# Altium project AMS_V3.PrjPcb
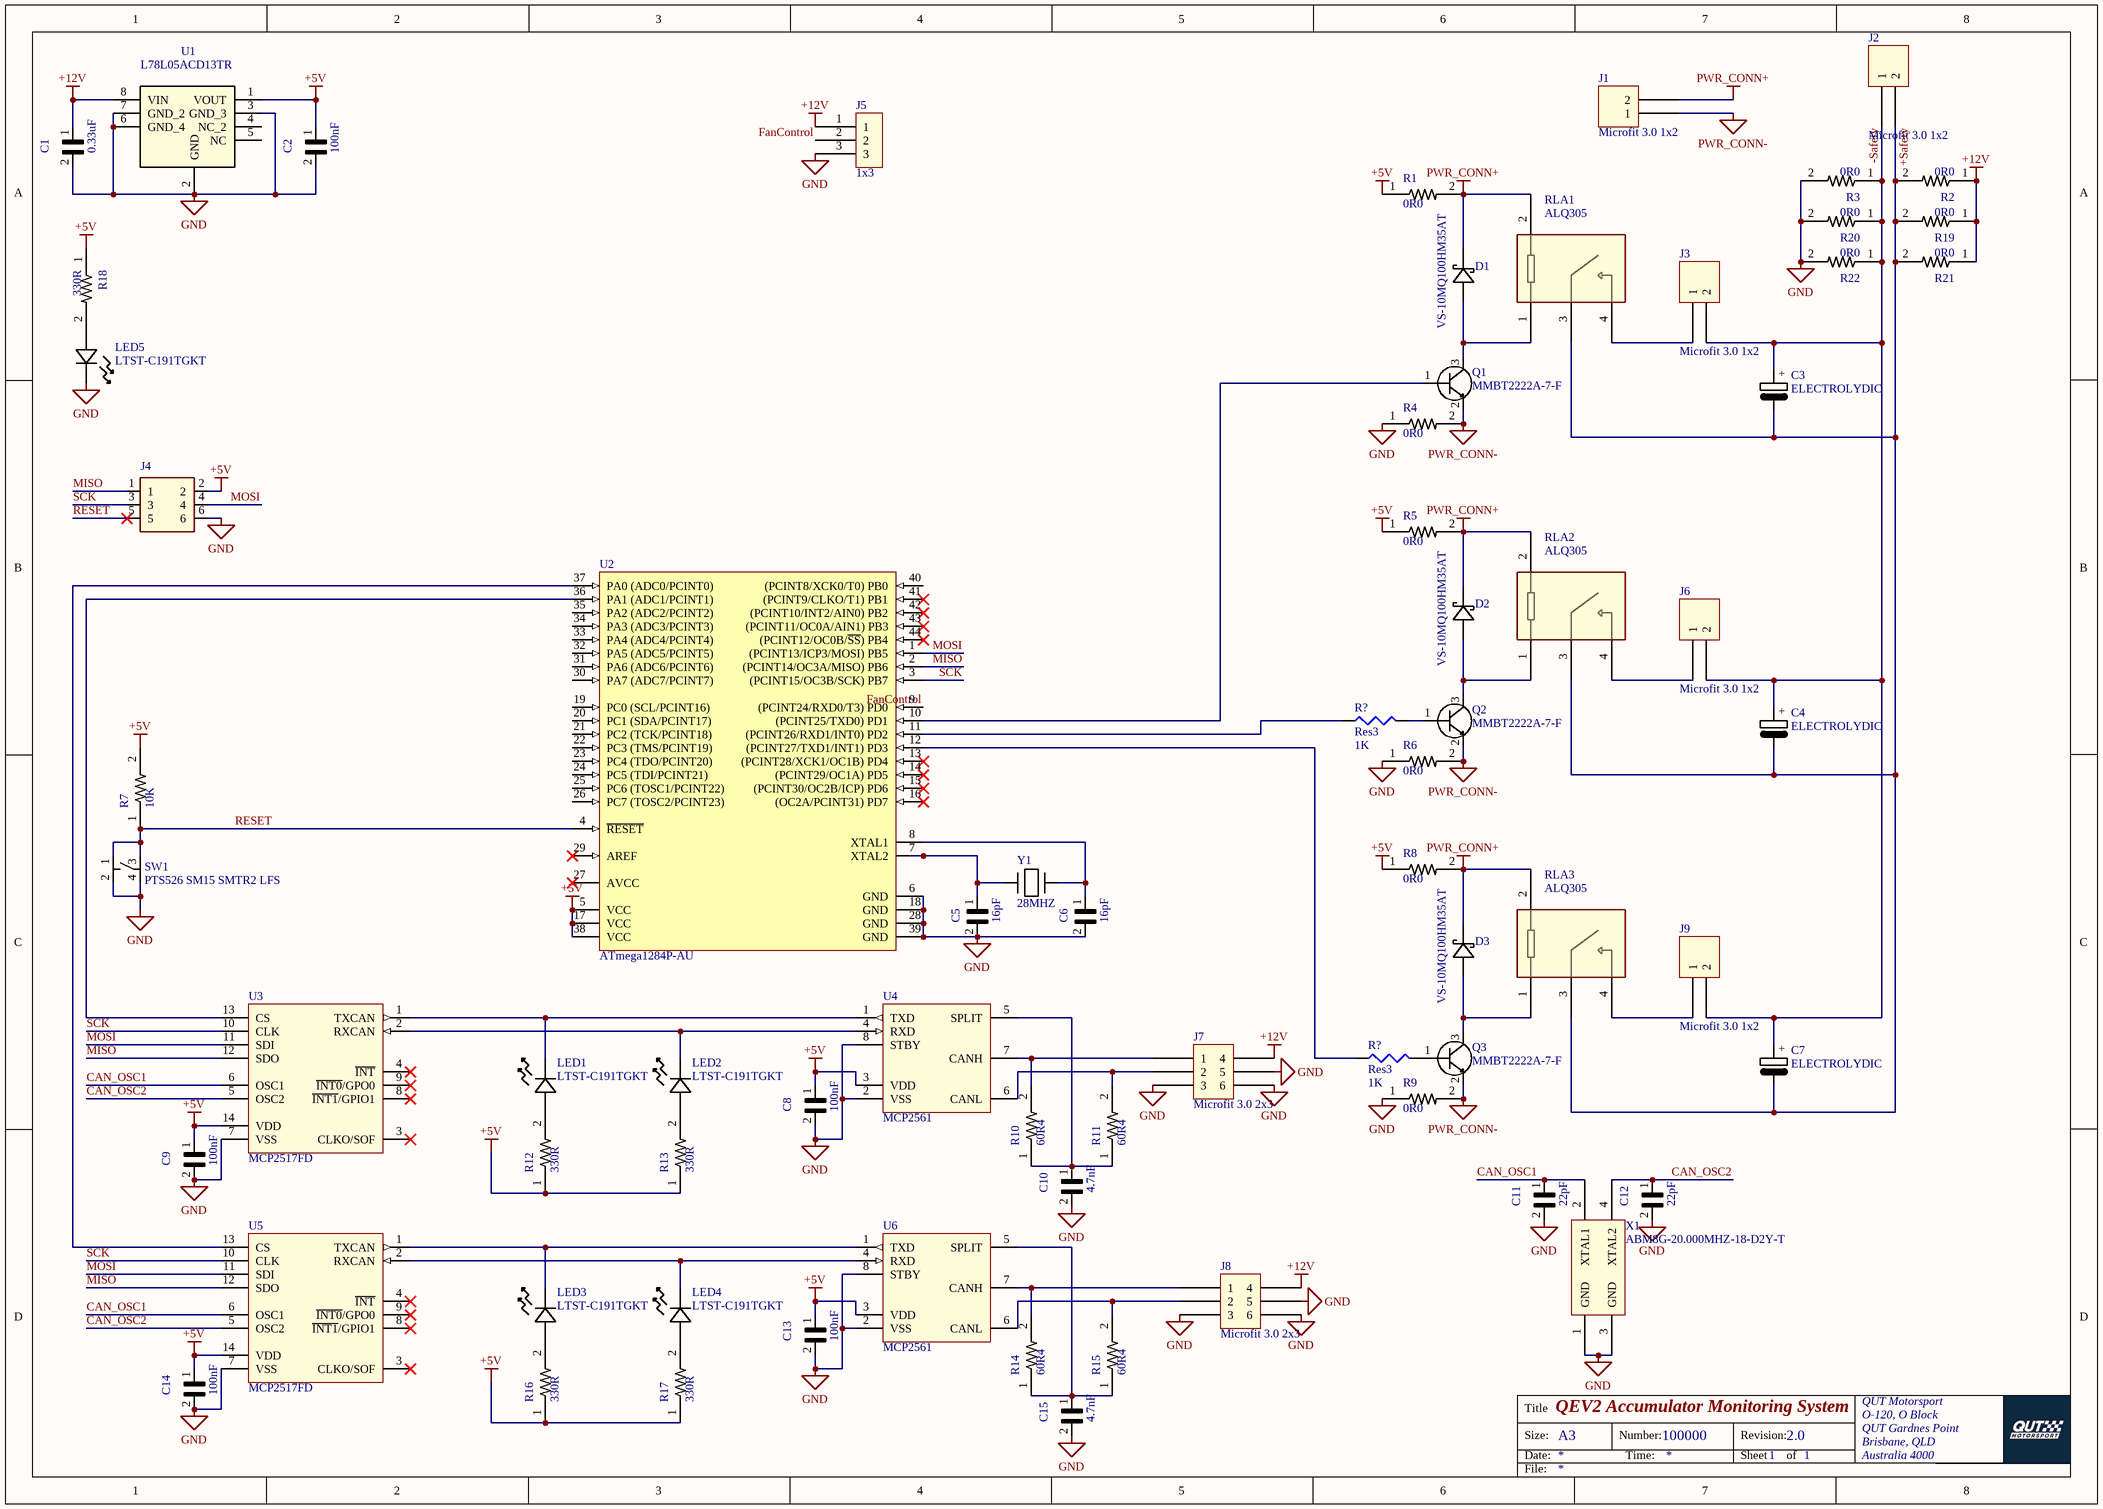
[diagram p0: AMS_V3.SchDoc]
1 sheet, 71 parts. Net scope: global (net labels, ports and power ports of the same name join across sheets).
Board file: AMS_V3.PcbDoc

## Sheet AMS_V3.SchDoc: QEV2 Accumulator Monitoring System
size A3; Author: Alistair Ridge; Organization: QUT Motorsport; Address1: O-120, O Block; Address2: QUT Gardnes Point; Address3: Brisbane, QLD; Address4: Australia 4000; DocumentNumber: 100000; Revision: 2.0; SheetNumber: 1; SheetTotal: 1

### Parts
(Parts that share a designator on the sheet are numbered #1, #2 ... from top to bottom, then left to right.)
C1  0.33uF  [*CAPC1608X95]
C2  100nF  [*CAPC1608X95]
C3  ELECTROLYDIC  [8mm_THT]
C4  ELECTROLYDIC  [8mm_THT]
C5  16pF  [*CAPC1608X95]
C6  16pF  [*CAPC1608X95]
C7  ELECTROLYDIC  [8mm_THT]
C8  100nF  [*CAPC1608X95]
C9  100nF  [*CAPC1608X95]
C10  4.7nF  [*CAPC1608X95]
C11  22pF  [*CAPC1608X95]
C12  22pF  [*CAPC1608X95]
C13  100nF  [*CAPC1608X95]
C14  100nF  [*CAPC1608X95]
C15  4.7nF  [*CAPC1608X95]
D1  VS-10MQ100HM35AT  [DIODE_SMA]
D2  VS-10MQ100HM35AT  [DIODE_SMA]
D3  VS-10MQ100HM35AT  [DIODE_SMA]
J1  Microfit 3.0 1x2  [Microfit_1X2_R_TH]
J2  Microfit 3.0 1x2  [Microfit_1X2_R_TH]
J3  Microfit 3.0 1x2  [Microfit_1X2_R_TH]
J4  826634-3  [TE_826634-3]  (value not drawn)
J5  1x3  [1x3]
J6  Microfit 3.0 1x2  [Microfit_1X2_R_TH]
J7  Microfit 3.0 2x3  [Microfit_2X3_R_TH]
J8  Microfit 3.0 2x3  [Microfit_2X3_R_TH]
J9  Microfit 3.0 1x2  [Microfit_1X2_R_TH]
LED1  LTST-C191TGKT  [LED_LTW-C193TS00]
LED2  LTST-C191TGKT  [LED_LTW-C193TS00]
LED3  LTST-C191TGKT  [LED_LTW-C193TS00]
LED4  LTST-C191TGKT  [LED_LTW-C193TS00]
LED5  LTST-C191TGKT  [LED_LTW-C193TS00]
Q1  MMBT2222A-7-F  [SOT-23]
Q2  MMBT2222A-7-F  [SOT-23]
Q3  MMBT2222A-7-F  [SOT-23]
R1  0R0  [RESC1608X55N]
R2  0R0  [RESC1608X55N]
R3  0R0  [RESC1608X55N]
R4  0R0  [RESC1608X55N]
R5  0R0  [RESC1608X55N]
R6  0R0  [RESC1608X55N]
R7  10K  [RESC1608X55N]
R8  0R0  [RESC1608X55N]
R9  0R0  [RESC1608X55N]
R10  60R4  [RESC1608X55N]
R11  60R4  [RESC1608X55N]
R12  330R  [RESC1608X55N]
R13  330R  [RESC1608X55N]
R14  60R4  [RESC1608X55N]
R15  60R4  [RESC1608X55N]
R16  330R  [RESC1608X55N]
R17  330R  [RESC1608X55N]
R18  330R  [RESC1608X55N]
R19  0R0  [RESC1608X55N]
R20  0R0  [RESC1608X55N]
R21  0R0  [RESC1608X55N]
R22  0R0  [RESC1608X55N]
R?#1  Res3  value 1K  [J1-0603]
R?#2  Res3  value 1K  [J1-0603]
RLA1  ALQ305  [ALQ105]
RLA2  ALQ305  [ALQ105]
RLA3  ALQ305  [ALQ105]
SW1  PTS526 SM15 SMTR2 LFS  [PTS526SK15SMTR2LFS]
U1  L78L05ACD13TR  [SOIC127P600X175-8N]
U2  ATmega1284P-AU  [44A_N]
U3  MCP2517FD  [MCP2517FD SOIC]
U4  MCP2561  [MCP2561 SOIC]
U5  MCP2517FD  [MCP2517FD SOIC]
U6  MCP2561  [MCP2561 SOIC]
X1  ABM8G-20.000MHZ-18-D2Y-T  [XTAL 3.2x2.5mm]
Y1  28MHZ  [ABLS_Series]

### Nets
+5V: C2.1 C8.1 C9.1 C13.1 C14.1 J4.2 R1.1 R5.1 R7.2 R8.1 R12.1 R13.1 R16.1 R17.1 R18.1 U1.1(VOUT) U2.5(VCC) U2.17(VCC) U2.38(VCC) U3.14(VDD) U4.3(VDD) U5.14(VDD) U6.3(VDD)
+12V: C1.1 J5.1 J7.4 J8.4 R2.1 R19.1 R21.1 U1.8(VIN)
GND: C1.2 C2.2 C5.2 C6.2 C8.2 C9.2 C10.2 C11.2 C12.2 C13.2 C14.2 C15.2 J4.6 J5.3 J7.3 J7.5 J7.6 J8.3 J8.5 J8.6 LED5.1 R3.2 R4.1 R6.1 R9.1 R20.2 R22.2 SW1.2 SW1.4 U1.2(GND) U1.3(GND_3) U1.6(GND_4) U1.7(GND_2) U2.6(GND) U2.18(GND) U2.28(GND) U2.39(GND) U3.7(VSS) U4.2(VSS) U4.8(STBY) U5.7(VSS) U6.2(VSS) U6.8(STBY) X1.1(GND) X1.3(GND)
PWR_CONN+: D1.1 D2.1 D3.1 J1.2 R1.2 R5.2 R8.2 RLA1.2 RLA2.2 RLA3.2
PWR_CONN-: J1.1 Q1.2 Q2.2 Q3.2 R4.2 R6.2 R9.2
+Safety: C3.2 C4.2 C7.2 J2.2 R2.2 R19.2 R21.2 RLA1.3 RLA2.3 RLA3.3
-Safety: C3.1 C4.1 C7.1 J2.1 J3.2 J6.2 J9.2 R3.1 R20.1 R22.1
CAN_OSC1: C11.1 U3.6(OSC1) U5.6(OSC1) X1.2(XTAL1)
CAN_OSC2: C12.1 U3.5(OSC2) U5.5(OSC2) X1.4(XTAL2)
FanControl: J5.2 U2.9((PCINT24/RXD0/T3)_PD0)
MISO: J4.1 U2.2((PCINT14/OC3A/MISO)_PB6) U3.12(SDO) U5.12(SDO)
MOSI: J4.4 U2.1((PCINT13/ICP3/MOSI)_PB5) U3.11(SDI) U5.11(SDI)
RESET: J4.5 R7.1 SW1.1 SW1.3 U2.4(~{RESET})
SCK: J4.3 U2.3((PCINT15/OC3B/SCK)_PB7) U3.10(CLK) U5.10(CLK)
NetC5_1: C5.1 U2.7(XTAL2) Y1.1
NetC6_1: C6.1 U2.8(XTAL1) Y1.2
NetC10_1: C10.1 R10.1 R11.1 U4.5(SPLIT)
NetC15_1: C15.1 R14.1 R15.1 U6.5(SPLIT)
NetD1_2: D1.2 Q1.3 RLA1.1
NetD2_2: D2.2 Q2.3 RLA2.1
NetD3_2: D3.2 Q3.3 RLA3.1
NetJ3_1: J3.1 RLA1.4
NetJ6_1: J6.1 RLA2.4
NetJ7_1: J7.1 R10.2 U4.7(CANH)
NetJ7_2: J7.2 R11.2 U4.6(CANL)
NetJ8_1: J8.1 R14.2 U6.7(CANH)
NetJ8_2: J8.2 R15.2 U6.6(CANL)
NetJ9_1: J9.1 RLA3.4
NetLED1_1: LED1.1 U3.1(TXCAN) U4.1(TXD)
NetLED1_2: LED1.2 R12.2
NetLED2_1: LED2.1 U3.2(RXCAN) U4.4(RXD)
NetLED2_2: LED2.2 R13.2
NetLED3_1: LED3.1 U5.1(TXCAN) U6.1(TXD)
NetLED3_2: LED3.2 R16.2
NetLED4_1: LED4.1 U5.2(RXCAN) U6.4(RXD)
NetLED4_2: LED4.2 R17.2
NetLED5_2: LED5.2 R18.2
NetQ1_1: Q1.1 U2.10((PCINT25/TXD0)_PD1)
NetQ2_1: Q2.1 R?#1.2
NetQ3_1: Q3.1 R?#2.2
NetR?#1_1: R?#1.1 U2.11((PCINT26/RXD1/INT0)_PD2)
NetR?#2_1: R?#2.1 U2.12((PCINT27/TXD1/INT1)_PD3)
NetU2_36: U2.36(PA1_(ADC1/PCINT1)) U3.13(CS)
NetU2_37: U2.37(PA0_(ADC0/PCINT0)) U5.13(CS)

Not connected (* = marked no-connect by the designer): U1 4(NC_2) 5(NC); U2 13((PCINT28/XCK1/OC1B)_PD4)* 14((PCINT29/OC1A)_PD5)* 15((PCINT30/OC2B/ICP)_PD6)* 16((OC2A/PCINT31)_PD7)* 19(PC0_(SCL/PCINT16)) 20(PC1_(SDA/PCINT17)) 21(PC2_(TCK/PCINT18)) 22(PC3_(TMS/PCINT19)) 23(PC4_(TDO/PCINT20)) 24(PC5_(TDI/PCINT21)) 25(PC6_(TOSC1/PCINT22)) 26(PC7_(TOSC2/PCINT23)) 27(AVCC)* 29(AREF)* 30(PA7_(ADC7/PCINT7)) 31(PA6_(ADC6/PCINT6)) 32(PA5_(ADC5/PCINT5)) 33(PA4_(ADC4/PCINT4)) 34(PA3_(ADC3/PCINT3)) 35(PA2_(ADC2/PCINT2)) 40((PCINT8/XCK0/T0)_PB0) 41((PCINT9/CLKO/T1)_PB1)* 42((PCINT10/INT2/AIN0)_PB2)* 43((PCINT11/OC0A/AIN1)_PB3)* 44((PCINT12/OC0B/~{SS})_PB4)*; U3 3(CLKO/SOF)* 4(~{INT})* 8(~{INT1}/GPIO1)* 9(~{INT0}/GPO0)*; U5 3(CLKO/SOF)* 4(~{INT})* 8(~{INT1}/GPIO1)* 9(~{INT0}/GPO0)*

### Notes on the sheet
- Title
- Size:
- Date:
- A3
- Number:
- Time:
- Revision:
- Sheet
- of
- File:
- (in symbol ELECTROLYDIC) +

### Library data of the parts
C1 C2 C5 C6 C8-C15 = CGJ3E3X7R1E334K080AB: / Cap Ceramic 0.33uF 25V X7R 10% SMD 0603 125Â°C Punched Paper T/R /; MF: TDK; Digi-Key_Part_Number: 445-13347-1-ND; MP: CGJ3E3X7R1E334K080AB; SnapEDA_Link: https://www.snapeda.com/parts/CGJ3E3X7R1E334K080AB/TDK-Lambda%20Americas%20Inc/view-part/?ref=snap; Package: 0603 TDK; Digi-Key_Purchase_URL: https://www.digikey.com.au/product-detail/en/tdk-corporation/CGJ3E3X7R1E334K080AB/445-13347-1-ND/3955013?utm_source=snapeda&utm_medium=aggregator&utm_campaign=symbol; Value: *
D1-D3 = VS-10MQ100HM35AT: No Description Available; Manufacturer_Part_Number: VS-10MQ100NPBF; Vendor: Vishay; Built_By: EMA_UL_Team; Type: DEV; Copyright: Copyright (C) 2018 Accelerated Designs. All rights reserved; RefDes: RefDes; Value: Value
J1-J3 J6 J9 = Microfit_1x2
J4 = 826634-3: Conn Unshrouded Header HDR 6 POS 2.54mm Solder RA Thru-Hole Automotive Carton; MF: TE Connectivity; Availability: Unavailable; SnapEDA_Link: https://www.snapeda.com/parts/826634-3/TE%20Connectivity%20AMP%20Connectors/view-part/?ref=snap; EU_RoHS_Compliance: Compliant; Price: None; TE_purchase_URL: https://www.te.com/usa-en/product-826634-3.html?te_bu=Cor&te_type=disp&te_campaign=seda_glo_cor-seda-global-disp-prtnr-fy19-seda-model-bom-cta_sma-317_1&elqCampaignId=32493; Package: None; MP: 826634-3; Value: *
J7 J8 = Microfit_2x3
LED1-LED5 = LTST-C191TGKT: No Description Available; Built_By: EMA_Justin; Vendor: Lite-On; Type: DEV; Copyright: Copyright (C) 2016 Accelerated Designs. All rights reserved; Manufacturer_Part_Number: LTST-C191TGKT; RefDes: RefDes; Value: Value
Q1-Q3 = MMBT2222A-7-F: No Description Available; Vendor: Diodes Inc; Built_By: EMA_UL_Team; Type: DEV; Manufacturer_Part_Number: MMBT2222A-7-F; Copyright: Copyright (C) 2018 Accelerated Designs. All rights reserved; RefDes: RefDes; Value: Value
R1-R22 = 10K: / Res Thick Film 0603 10K Ohm 5% 0.25W_1/4W_ Â±200ppm/C Molded SMD Automotive T/R /; MP: ESR03EZPJ103; MF: Rohm; Package: 0603 Rohm; SnapEDA_Link: https://www.snapeda.com/parts/ESR03EZPJ103/Rohm/view-part/?ref=snap; Price: None; Availability: Unavailable; Value: *
R?#1 R?#2 = Res3: Resistor; Published: 8-Jun-2000; LatestRevisionDate: 29-May-2009; LatestRevisionNote: IPC-7351 Footprint Added.; PackageReference: J1-0603; Publisher: Altium Limited; PackageDescription: Chip Resistor
RLA1-RLA3 = ALQ305: No Description Available; Vendor: Panasonic; Built_By: EMA_UL_Team; Manufacturer_Part_Number: ALQ305; Copyright: Copyright (C) 2018 Accelerated Designs. All rights reserved; RefDes: RefDes; Type: DEV; Value: Value
SW1 = PTS526 SM15 SMTR2 LFS: TACT 5.2 X 5.2, 1.5 MM H, 160GF, / SPST-NO Top Actuated Surface Mount
U1 = L78L05ACD13TR: L78L Series 20 V 100 mA Surface Mount Positive Voltage Regulator - SOIC-8; MF: STMicroelectronics; Package: SOIC-8 STMicroelectronics; MP: L78L05ACD13TR; SnapEDA_Link: https://www.snapeda.com/parts/L78L05ACD13TR/STMicroelectronics/view-part/?ref=snap; Price: None; Availability: Unavailable; Value: *
U2 = CMP-0107-00053-1: 20 MHz 8-bit AVR Microcontroller with 128KB Flash, 44-Pin TQFP Pkg, Industrial Temp; PackageVersion: rev.B, Oct-2001; PackageReference: 44A; DatasheetVersion: revD, Nov-2009; PackageDescription: 44-Pin Plastic Thin Profile Quad Flat Pack, 10 x 10 x 1.0 mm Body, 0.8 mm Pitch (TQFP)
X1 = Crystal 20Mhz 3.2x2.5mm: 20MHz ±20ppm Crystal 18pF 80 Ohms 4-SMD, No Lead; ComponentLink1Description: Digikey; ComponentLink1URL: https://www.digikey.com.au/product-detail/en/abracon-llc/ABM8G-20.000MHZ-18-D2Y-T/535-10271-1-ND/2218084; ComponentLink2Description: Datasheet; ComponentLink2URL: https://abracon.com/Resonators/ABM8G.pdf; ComponentLink3Description: Drawing; ComponentLink3URL: https://abracon.com/Support/PackageDrawing/Resonators/ABM8G.PDF
Y1 = ABLS-28.63636MHZ: No Description Available; Manufacturer_Part_Number: ABLS-28.63636MHZ-CL-RESR-A-1-G-F; Vendor: Abracon; Built_By: EMA_UL_Team; Copyright: Copyright (C) 2018 Accelerated Designs. All rights reserved; RefDes: RefDes; Type: DEV; Value: Value